# Altium schematic sheet INTERNAL_REGULATORS.SchDoc
size E; SheetNumber: 5; SheetTotal: 5
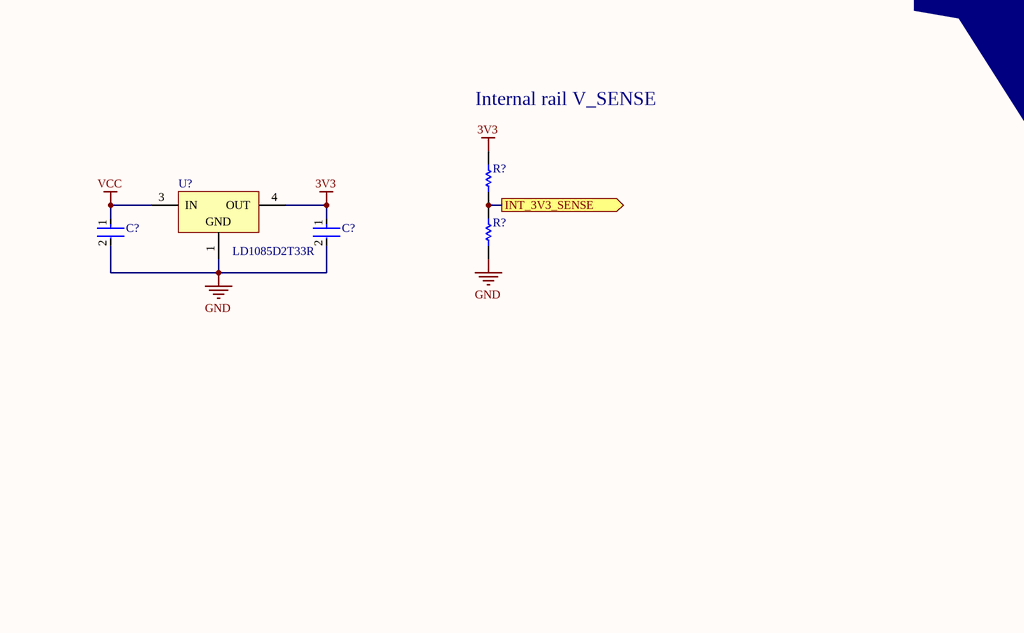
[diagram p0: INTERNAL_REGULATORS.SchDoc, top column 2 of 4]
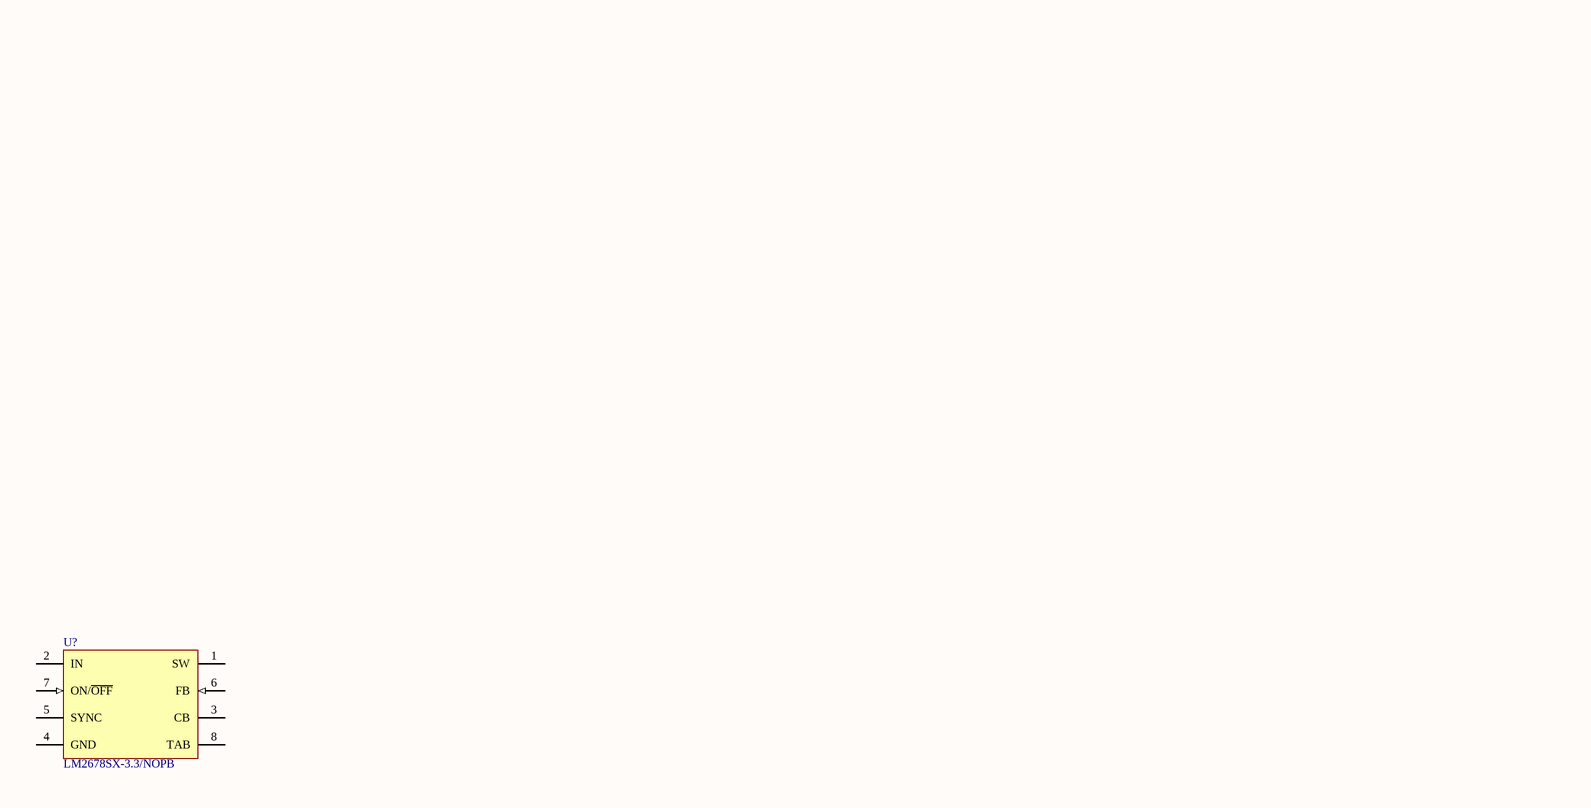
[diagram p1: INTERNAL_REGULATORS.SchDoc, bottom column 1 of 4]

## Parts
(Parts that share a designator on the sheet are numbered #1, #2 ... from top to bottom, then left to right.)
C?#1  C0805C106K8PACTU  [FP-C0805C-DG-MFG]  (value not drawn)
C?#2  C0805C106K8PACTU  [FP-C0805C-DG-MFG]  (value not drawn)
R?#1  ERJ3EKF1002V  [RESC1609X55X30LL15T15]  (value not drawn)
R?#2  ERJ3EKF1002V  [RESC1609X55X30LL15T15]  (value not drawn)
U?#1  LD1085D2T33R  [TO-263_N]
U?#2  LM2678SX-3.3/NOPB  [KTW0007B_M]

## Ports
INT_3V3_SENSE (out)

## Nets
3V3: C?#2.1 R?#1.2 U?#1.4(OUT)
GND: C?#1.2 C?#2.2 R?#2.1 U?#1.1(GND)
VCC: C?#1.1 U?#1.3(IN)
INT_3V3_SENSE: R?#1.1 R?#2.2 ; port INT_3V3_SENSE

Not connected (* = marked no-connect by the designer): U?#2 1(SW) 2(IN) 3(CB) 4(GND) 5(SYNC) 6(FB) 7(ON/~{OFF}) 8(TAB)

## Notes on the sheet
- Internal rail V_SENSE
- Yep
- That's all folks

## Library data of the parts
C?#1 C?#2 = CMP-2007-03243-2: CAP CER 10UF 10V X5R 0805; Manufacturer: Kemet; 3DS Part Number: 220-00001; Tolerance: 10%; Temperature Coefficient: 15%; Material: Ceramic; Device Class L2: Capacitors; Device Class L1: Passive Components; ComponentLink2URL: https://content.kemet.com/datasheets/KEM_C1006_X5R_SMD.pdf; Height: 1.4mm; Lead Free: Yes; Manufacturer Part Number: C0805C106K8PACTU; Digikey Description: CAP CER 10UF 10V X5R 0805; Octopart: https://octopart.com/c0805c106k8pactu-kemet-98697; Capacitance: 10uF; Value: 10uF; Temperature Range Low: -55°C; Temperature: -55°C to +85°C; Automotive: No; Mouser Description: CAP CER 10UF 10V X5R 0805; Ipc Land Pattern Name: CAPC200125X125; Temperature Range High: +85°C; Voltage: 10V; RoHS: TRUE; Device Class L3: Ceramic Capacitors; ComponentLink2Description: Datasheet; Voltage Rating: 10V; Package: C0805C-DG; Temperature Characteristic: X5R; Category: Cap
R?#1 R?#2 = CMP-1012-00623-3: Chip Resistor, 10 KOhm, +/- 1%, 0.1 W, -55 to 155 degC, 0603 (1608 Metric), RoHS, Tape and Reel; Manufacturer: Panasonic; Voltage Rating: 75V; Case\/Package: 0603; Power Rating: 100mW; Resistance: 10KOhm; Temperature Coefficient: 100ppm\/degreesC; Number of Pins: 2; Package Reference: 603; Depth: 0.8mm; Mount: SurfaceMount; Package Description: 2-Pin Surface Mount Device, Body 1.6 x 0.85 mm; Datasheet Version: 02/2017; Length: 1.6mm; Lead Free: LeadFree; Height: 0.45mm; Number of Terminations: 2; Max Power Dissipation: 100mW; Min Operating Temperature: -55degC; Datasheet URL: https://industrial.panasonic.com/cdbs/www-data/pdf/RDA0000/AOA0000C304.pdf; Termination: SMD/SMT; Case Code (Metric): 1608; Case Code (Imperial): 0603; Tolerance: 1%; Max Operating Temperature: 155degC; RoHSCompliant: true; Voltage Rating (DC): 75V; Radiation Hardening: No; Packaging: TapeandReel; Composition: ThickFilm; Mounting Technology: SurfaceMount; Manufacturer URL: http://www.panasonic.com/; Width: 0.031inch; REACH SVHC: NoSVHC; Contact Plating: Tin; Military Standard: Not; Package Quantity: 1
U?#1 = CMP-0244-00169-1: 3A, Low Drop Positive Voltage Regulator, 3.3V, 3-Pin D2PAK; ComponentLink1URL: http://www.st.com; PackageVersion: 2011; ComponentLink1Description: Manufacturer URL; ComponentLink2URL: http://www.st.com/internet/com/TECHNICAL_RESOURCES/TECHNICAL_LITERATURE/DATASHEET/CD00001883.pdf; PackageDescription: 3-Pin Transistor Outline Package 2.54 mm Pitch, 15.4 mm Lead Span (D2PAK); DatasheetVersion: 28/07/2009; ComponentLink2Description: Datasheet; PackageReference: TO-263
U?#2 = CMP-0069-00200-3: VERY MUCH NOT A LM2677, USE A LM2678SX-3.3/NOPB; Manufacturer: Texas Instruments; PackageTopMarking: NSUZXYTTE#*LM2677S*-3.3; CompType: Switcher; PowerWise: N; Code_JEDEC: MO-169-AC; ComponentLink1URL: http://www.ti.com/general/docs/lit/getliterature.tsp?genericPartNumber=LM2677&fileType=pdf; PackageDescription: TO-263, Molded, .400 x .390 x .180in Body, 7 Lead, .050in Pitch, Surface Mount; PinCount: 7; ComponentLink1Description: Datasheet URL; RoHS: Y; PackageReference: KTW0007B